# Altium schematic sheet FOC-MESC mini.SchDoc
size A4; SheetNumber: 1; SheetTotal: 1
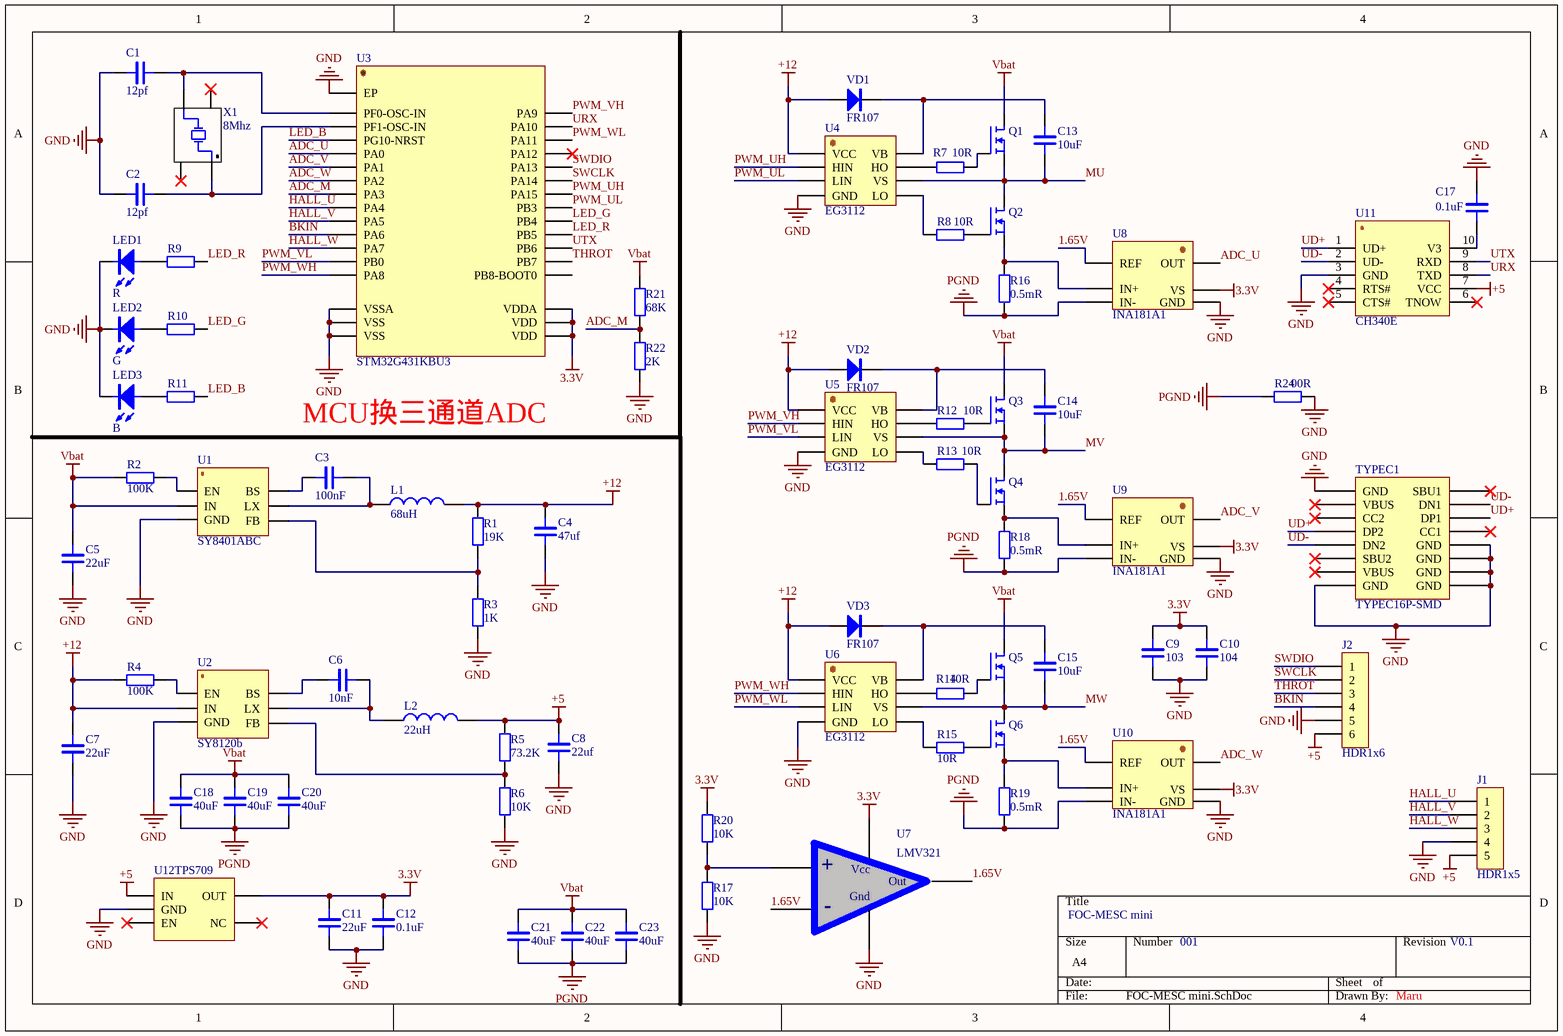
[diagram p0: FOC-MESC mini.SchDoc]

## Parts
C1  12pf  [LC-0603_C]
C2  12pf  [LC-0603_C]
C3  100nF  [LC-0603_C]
C4  47uf  [LC-0603_C]
C5  22uF  [LC-0603_C]
C6  10nF  [LC-0603_C]
C7  22uF  [LC-0603_C]
C8  22uf  [LC-0603_C]
C9  103  [LC-0603_C]
C10  104  [LC-0603_C]
C11  22uF  [LC-0603_C]
C12  0.1uF  [LC-0603_C]
C13  10uF  [LC-0603_C]
C14  10uF  [LC-0603_C]
C15  10uF  [LC-0603_C]
C17  0.1uF  [LC-0603_C]
C18  40uF  [LC-1206_C]
C19  40uF  [LC-1206_C]
C20  40uF  [LC-1206_C]
C21  40uF  [LC-1206_C]
C22  40uF  [LC-1206_C]
C23  40uF  [LC-1206_C]
J1  HDR1x5  [HDR-1X5]
J2  HDR1x6  [PH2.0 S-W-6P]
L1  68uH  [CD31]
L2  22uH  [CD31]
LED1  R  [LED-0603]
LED2  G  [LED-0603]
LED3  B  [LED-0603]
Q1  N-MOSFET  [LC-DFN-8_5x6mm]  (value not drawn)
Q2  N-MOSFET  [LC-DFN-8_5x6mm]  (value not drawn)
Q3  N-MOSFET  [LC-DFN-8_5x6mm]  (value not drawn)
Q4  N-MOSFET  [LC-DFN-8_5x6mm]  (value not drawn)
Q5  N-MOSFET  [LC-DFN-8_5x6mm]  (value not drawn)
Q6  N-MOSFET  [LC-DFN-8_5x6mm]  (value not drawn)
R1  19K  [LC-0603_R]
R2  100K  [LC-0603_R]
R3  1K  [LC-0603_R]
R4  100K  [LC-0603_R]
R5  73.2K  [LC-0603_R]
R6  10K  [LC-0603_R]
R7  10R  [LC-0603_R]
R8  10R  [LC-0603_R]
R9  800R  [LC-0603_R]  (value not drawn)
R10  800R  [LC-0603_R]  (value not drawn)
R11  800R  [LC-0603_R]  (value not drawn)
R12  10R  [LC-0603_R]
R13  10R  [LC-0603_R]
R14  10R  [LC-0603_R]
R15  10R  [LC-0603_R]
R16  0.5mR  [LC-2512_R]
R17  10K  [LC-0603_R]
R18  0.5mR  [LC-2512_R]
R19  0.5mR  [LC-2512_R]
R20  10K  [LC-0603_R]
R21  68K  [LC-0603_R]
R22  2K  [LC-0603_R]
R24  00R  [LC-1206_R]
TYPEC1  TYPEC16P-SMD  [TYPEC-16PIN DIP]
U1  SY8401ABC  [LC-SOT-23-6]
U2  SY8120b  [LC-SOT-23-6]
U3  STM32G431KBU3  [LC-QFN-32_7x7x065P]
U4  EG3112  [LC-SOIC-8_150mil]
U5  EG3112  [LC-SOIC-8_150mil]
U6  EG3112  [LC-SOIC-8_150mil]
U7  LMV321  [LC-SOT-23-5]
U8  INA181A1  [LC-SOT-23-6]
U9  INA181A1  [LC-SOT-23-6]
U10  INA181A1  [LC-SOT-23-6]
U11  CH340E  [LC-MSOP-10]
U12  TPS709  [LC-SOT-23-5]
VD1  FR107  [LC-SOD-123F]
VD2  FR107  [LC-SOD-123F]
VD3  FR107  [LC-SOD-123F]
X1  8Mhz  [XTAL-5.0X3.2]

## Nets
3.3V: C9.2 C10.2 C11.2 C12.2 R20.2 U3.1(VDD) U3.15(VDDA) U3.17(VDD) U7.5 U8.6(VS) U9.6(VS) U10.6(VS) U12.5(OUT)
+5: C8.1 J1.5 J2.6 L2.2 R5.2 U11.7(VCC) U12.1(IN)
+12: C4.2 C7.2 L1.2 R1.2 R4.1 U2.5(IN) U4.1(VCC) U5.1(VCC) U6.1(VCC) VD1.1(A) VD2.1(A) VD3.1(A)
GND: C1.1 C2.1 C4.1 C5.1 C7.1 C8.2 C9.1 C10.1 C11.1 C12.1 C17.2 J1.4 J2.5 LED1.2(C) LED2.2(C) LED3.2(C) R3.1 R6.1 R17.1 R22.2 R24.1 TYPEC1.13(GND) TYPEC1.14(GND) TYPEC1.15(GND) TYPEC1.16(GND) TYPEC1.A1B12(GND) TYPEC1.B1A12(GND) U1.2(GND) U2.2(GND) U3.0(EP) U3.14(VSSA) U3.16(VSS) U3.32(VSS) U4.4(GND) U5.4(GND) U6.4(GND) U7.2(VSS) U8.2(GND) U9.2(GND) U10.2(GND) U11.3(GND) U12.2(GND)
PGND: C18.1 C19.1 C20.1 C21.1 C22.1 C23.1 R16.1 R18.1 R19.1 R24.2 U8.4(IN-) U9.4(IN-) U10.4(IN-)
Vbat: C5.2 C18.2 C19.2 C20.2 C21.2 C22.2 C23.2 Q1.2(D) Q3.2(D) Q5.2(D) R2.1 R21.1 U1.5(IN)
1.65V: U7.1 U7.4 U8.5(REF) U9.5(REF) U10.5(REF)
ADC_M: R21.2 R22.1 U3.8(PA3)
ADC_U: U3.5(PA0) U8.1(OUT)
ADC_V: U3.6(PA1) U9.1(OUT)
ADC_W: U3.7(PA2) U10.1(OUT)
BKIN: J2.4 U3.11(PA6)
HALL_U: J1.1 U3.9(PA4)
HALL_V: J1.2 U3.10(PA5)
HALL_W: J1.3 U3.12(PA7)
LED_B: R11.1 U3.4(PG10-NRST)
LED_G: R10.1 U3.27(PB4)
LED_R: R9.1 U3.28(PB5)
MU: C13.1 Q1.3(S) Q2.2(D) U4.6(VS)
MV: C14.1 Q3.3(S) Q4.2(D) U5.6(VS)
MW: C15.1 Q5.3(S) Q6.2(D) U6.6(VS)
PWM_UH: U3.25(PA15) U4.2(HIN)
PWM_UL: U3.26(PB3) U4.3(LIN)
PWM_VH: U3.19(PA9) U5.2(HIN)
PWM_VL: U3.13(PB0) U5.3(LIN)
PWM_WH: U3.18(PA8) U6.2(HIN)
PWM_WL: U3.21(PA11) U6.3(LIN)
SWCLK: J2.2 U3.24(PA14)
SWDIO: J2.1 U3.23(PA13)
THROT: J2.3 U3.30(PB7)
UD+: TYPEC1.A6(DP1) TYPEC1.B6(DP2) U11.1(UD+)
UD-: TYPEC1.A7(DN1) TYPEC1.B7(DN2) U11.2(UD-)
URX: U3.20(PA10) U11.8(TXD)
UTX: U3.29(PB6) U11.9(RXD)
NetC1_2: C1.2 U3.2(PF0-OSC-IN) X1.3(OSC)
NetC2_2: C2.2 U3.3(PF1-OSC-IN) X1.1(OSC)
NetC3_1: C3.1 L1.1 U1.6(LX)
NetC3_2: C3.2 U1.1(BS)
NetC6_1: C6.1 L2.1 U2.6(LX)
NetC6_2: C6.2 U2.1(BS)
NetC13_2: C13.2 U4.8(VB) VD1.2(K)
NetC14_2: C14.2 U5.8(VB) VD2.2(K)
NetC15_2: C15.2 U6.8(VB) VD3.2(K)
NetC17_1: C17.1 U11.10(V3)
NetLED1_1: LED1.1(A) R9.2
NetLED2_1: LED2.1(A) R10.2
NetLED3_1: LED3.1(A) R11.2
NetQ1_1: Q1.1(G) R7.1
NetQ2_1: Q2.1(G) R8.1
NetQ2_3: Q2.3(S) R16.2 U8.3(IN+)
NetQ3_1: Q3.1(G) R12.1
NetQ4_1: Q4.1(G) R13.1
NetQ4_3: Q4.3(S) R18.2 U9.3(IN+)
NetQ5_1: Q5.1(G) R14.1
NetQ6_1: Q6.1(G) R15.1
NetQ6_3: Q6.3(S) R19.2 U10.3(IN+)
NetR1_1: R1.1 R3.2 U1.3(FB)
NetR2_2: R2.2 U1.4(EN)
NetR4_2: R4.2 U2.4(EN)
NetR5_1: R5.1 R6.2 U2.3(FB)
NetR7_2: R7.2 U4.7(HO)
NetR8_2: R8.2 U4.5(LO)
NetR12_2: R12.2 U5.7(HO)
NetR13_2: R13.2 U5.5(LO)
NetR14_2: R14.2 U6.7(HO)
NetR15_2: R15.2 U6.5(LO)
NetR17_2: R17.2 R20.1 U7.3

Not connected (* = marked no-connect by the designer): TYPEC1 A4B9(VBUS)* A5(CC1)* A8(SBU1)* B4A9(VBUS)* B5(CC2)* B8(SBU2)*; U3 22(PA12)* 31(PB8-BOOT0); U11 4(RTS#)* 5(CTS#)* 6(TNOW)*; U12 3(EN)* 4(NC)*; X1 2(11)* 4(OSC)*

## Notes on the sheet
- MCU换三通道ADC
- FOC-MESC mini
- 001
- V0.1
- Maru
- (in symbol OPA-Single) +; Vcc; Out; Gnd; -

## Library data of the parts
C1-C15 C17-C23 = CAP: Capacitor
J1 = HDR1x5: Connector
J2 = HDR1x6: Connector
L1 L2 = L: 小功率贴片电感; 版权归属: 源创客; BOM名称: 小功率贴片电感; 学习资源: www.ooocke.com
LED1-LED3 = LED
R1-R22 R24 = RES: Resistor
U1 U2 = SY8120b: DC-DC
U7 = OPA-Single
U8-U10 = INA181A1: 40 倍
VD1-VD3 = FR107: 快恢复整流二极管; BOM名称: 快恢复二极管; 版权归属: 源创客; 属性: 700V/1A; 学习资源: www.ooocke.com
X1 = XTAL-4 Crystal